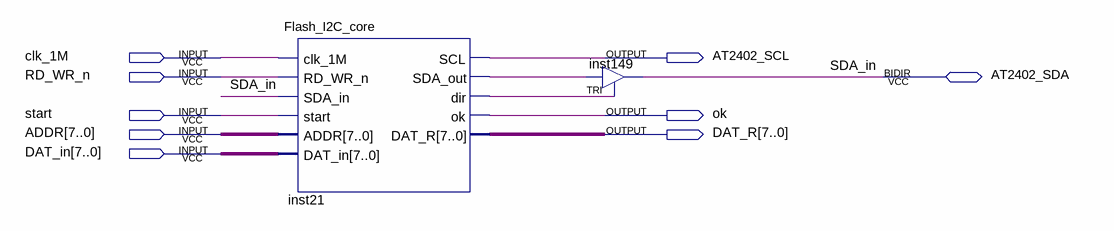
[diagram p0: schematic sheet]
// Quartus schematic AT24C02.bdf as structural Verilog: 2 symbols, 9 pins
module AT24C02 (
  input  clk_1M,
  input  RD_WR_n,
  input  start,
  input  [7:0] ADDR,
  input  [7:0] DAT_in,
  inout  AT2402_SDA,
  output AT2402_SCL,
  output ok,
  output [7:0] DAT_R
);

  wire inst21_dir, inst21_sda_out;

  Flash_I2C_core inst21 (
    .clk_1M(clk_1M), .RD_WR_n(RD_WR_n), .SDA_in(AT2402_SDA), .start(start), .ADDR(ADDR), .DAT_in(DAT_in),
    .SCL(AT2402_SCL), .SDA_out(inst21_sda_out), .dir(inst21_dir), .ok(ok), .DAT_R(DAT_R));
  TRI inst149 (.IN(inst21_sda_out), .OE(inst21_dir), .OUT(AT2402_SDA));

  // Other names for the same wires on the sheet: SDA_in = AT2402_SDA
endmodule
